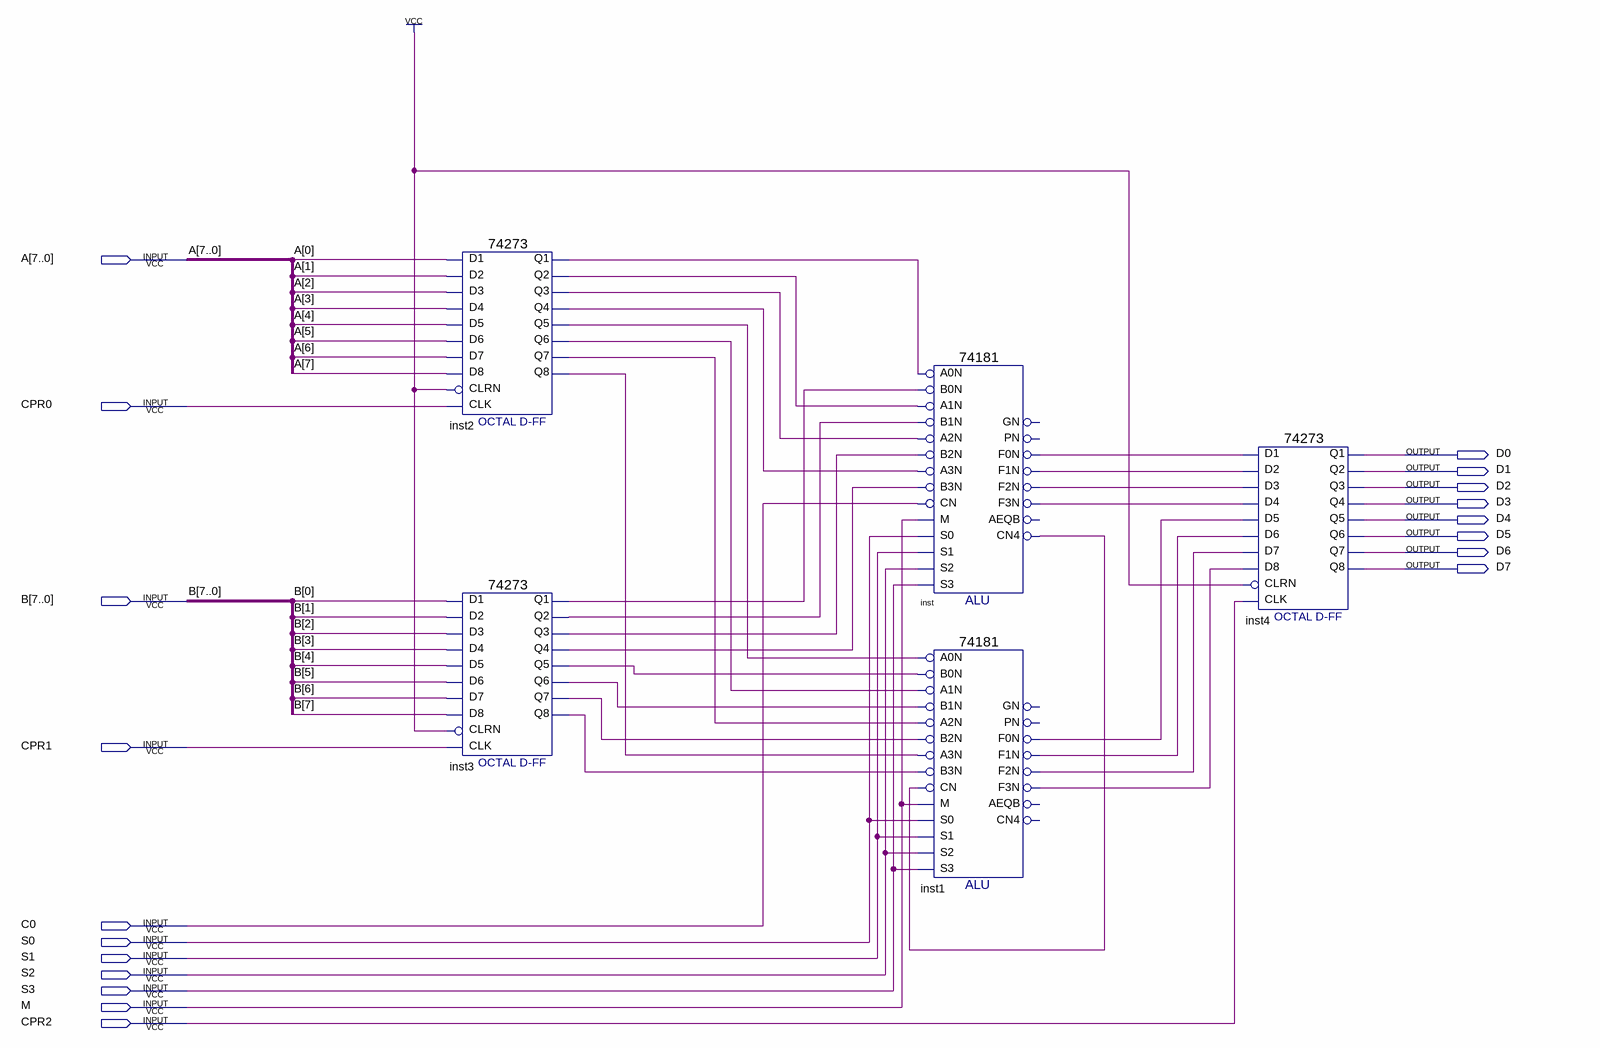
[diagram p0: schematic sheet]
// Quartus schematic alu.bdf as structural Verilog: 5 symbols, 19 pins
module alu (
  input  [7:0] A,
  input  CPR0,
  input  [7:0] B,
  input  CPR1,
  input  C0,
  input  S0,
  input  S1,
  input  S2,
  input  S3,
  input  M,
  input  CPR2,
  output D0,
  output D1,
  output D2,
  output D3,
  output D4,
  output D5,
  output D6,
  output D7
);

  wire inst1_f0n, inst1_f1n, inst1_f2n, inst1_f3n, inst2_q1, inst2_q2, inst2_q3, inst2_q4, inst2_q5,
       inst2_q6, inst2_q7, inst2_q8, inst3_q1, inst3_q2, inst3_q3, inst3_q4, inst3_q5, inst3_q6, inst3_q7,
       inst3_q8, inst_cn4, inst_f0n, inst_f1n, inst_f2n, inst_f3n;

  \74273  inst2 (
    .D2(A[1]), .D3(A[2]), .D1(A[0]), .D4(A[3]), .D7(A[6]), .D6(A[5]), .D5(A[4]), .D8(A[7]), .CLK(CPR0),
    .CLRN(1'b1), .Q4(inst2_q4), .Q1(inst2_q1), .Q2(inst2_q2), .Q3(inst2_q3), .Q6(inst2_q6), .Q5(inst2_q5),
    .Q7(inst2_q7), .Q8(inst2_q8));
  \74273  inst3 (
    .D2(B[1]), .D3(B[2]), .D1(B[0]), .D4(B[3]), .D7(B[6]), .D6(B[5]), .D5(B[4]), .D8(B[7]), .CLK(CPR1),
    .CLRN(1'b1), .Q4(inst3_q4), .Q1(inst3_q1), .Q2(inst3_q2), .Q3(inst3_q3), .Q6(inst3_q6), .Q5(inst3_q5),
    .Q7(inst3_q7), .Q8(inst3_q8));
  \74181  inst (
    .B0N(inst3_q1), .A0N(inst2_q1), .A1N(inst2_q2), .B1N(inst3_q2), .A3N(inst2_q4), .B2N(inst3_q3),
    .A2N(inst2_q3), .M(M), .CN(C0), .B3N(inst3_q4), .S2(S2), .S1(S1), .S0(S0), .S3(S3), .F3N(inst_f3n),
    .F1N(inst_f1n), .F0N(inst_f0n), .CN4(inst_cn4), .F2N(inst_f2n));  // open: PN, GN, AEQB
  \74181  inst1 (
    .B0N(inst3_q5), .A0N(inst2_q5), .A1N(inst2_q6), .B1N(inst3_q6), .A3N(inst2_q8), .B2N(inst3_q7),
    .A2N(inst2_q7), .M(M), .CN(inst_cn4), .B3N(inst3_q8), .S2(S2), .S1(S1), .S0(S0), .S3(S3),
    .F3N(inst1_f3n), .F1N(inst1_f1n), .F0N(inst1_f0n), .F2N(inst1_f2n));  // open: PN, GN, AEQB, CN4
  \74273  inst4 (
    .D2(inst_f1n), .D3(inst_f2n), .D1(inst_f0n), .D4(inst_f3n), .D7(inst1_f2n), .D6(inst1_f1n),
    .D5(inst1_f0n), .D8(inst1_f3n), .CLK(CPR2), .CLRN(1'b1), .Q4(D3), .Q1(D0), .Q2(D1), .Q3(D2), .Q6(D5),
    .Q5(D4), .Q7(D6), .Q8(D7));
endmodule
